# EAGLE schematic W25Q64_FLASH_SMD_0603 (EAGLE 7.7.0)
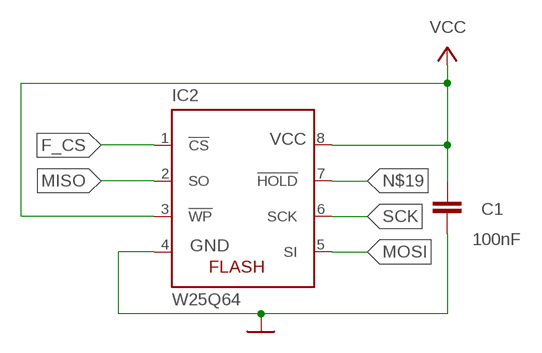
[diagram p0: schematic, sheet 1]

## Parts
C1  100nF  C-EUC0603  [C0603]
IC2  W25Q64  25AA040ST  [TSSOP8]

## Nets
F_CS: IC2.1(!CS)
GND: C1.1 IC2.4(GND)
MISO: IC2.2(SO)
MOSI: IC2.5(SI)
N$19: IC2.7(!HOLD)
SCK: IC2.6(SCK)
VCC: C1.2 IC2.3(!WP) IC2.8(VCC)

## Library data of the parts
C1 = rcl:C-EU: CAPACITOR, European symbol
IC2 = microchip:25*: Serial EEPROM 4K/ 8K , SPI bus; MPN: 25AA040A-I/MS; OC_FARNELL: 1331345; OC_NEWARK: 35M0801

## Net classes
1 vcc: width 0.254 mm